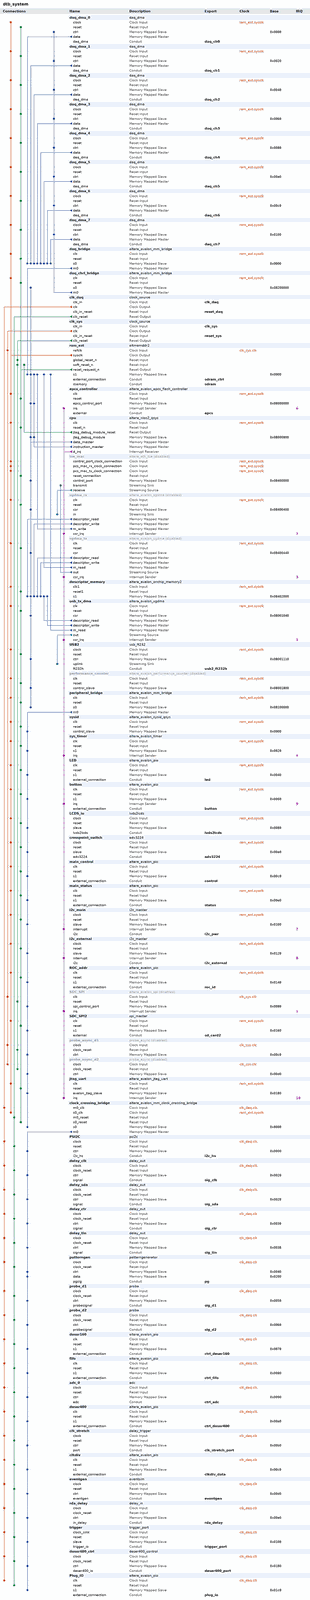
[diagram p0: system contents, whole]
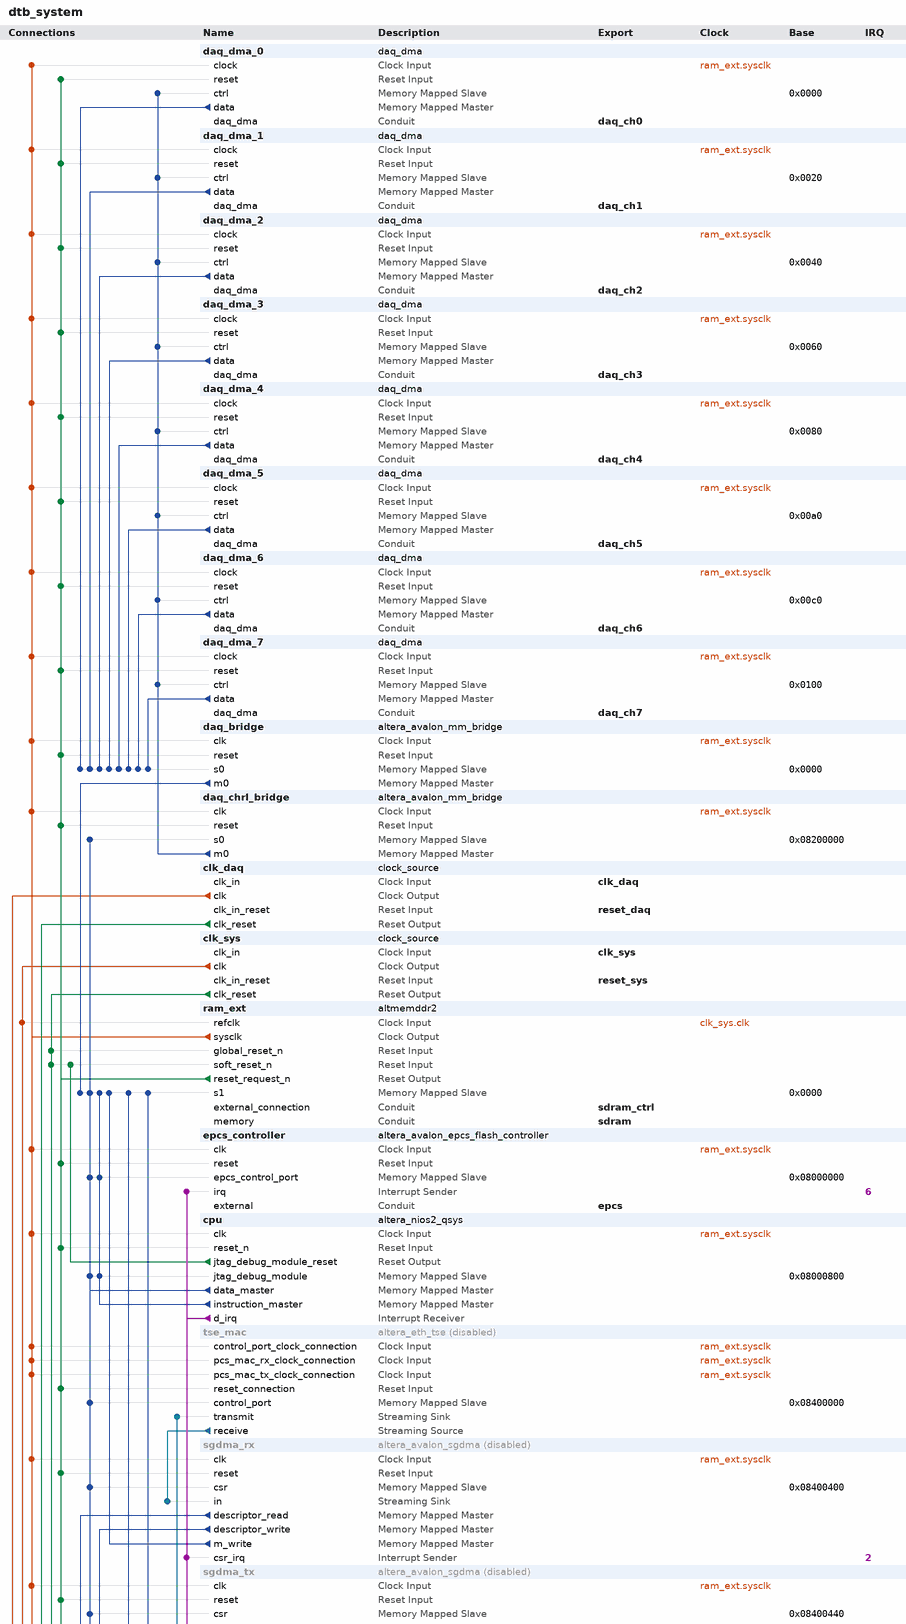
[diagram p1: system contents, upper part]
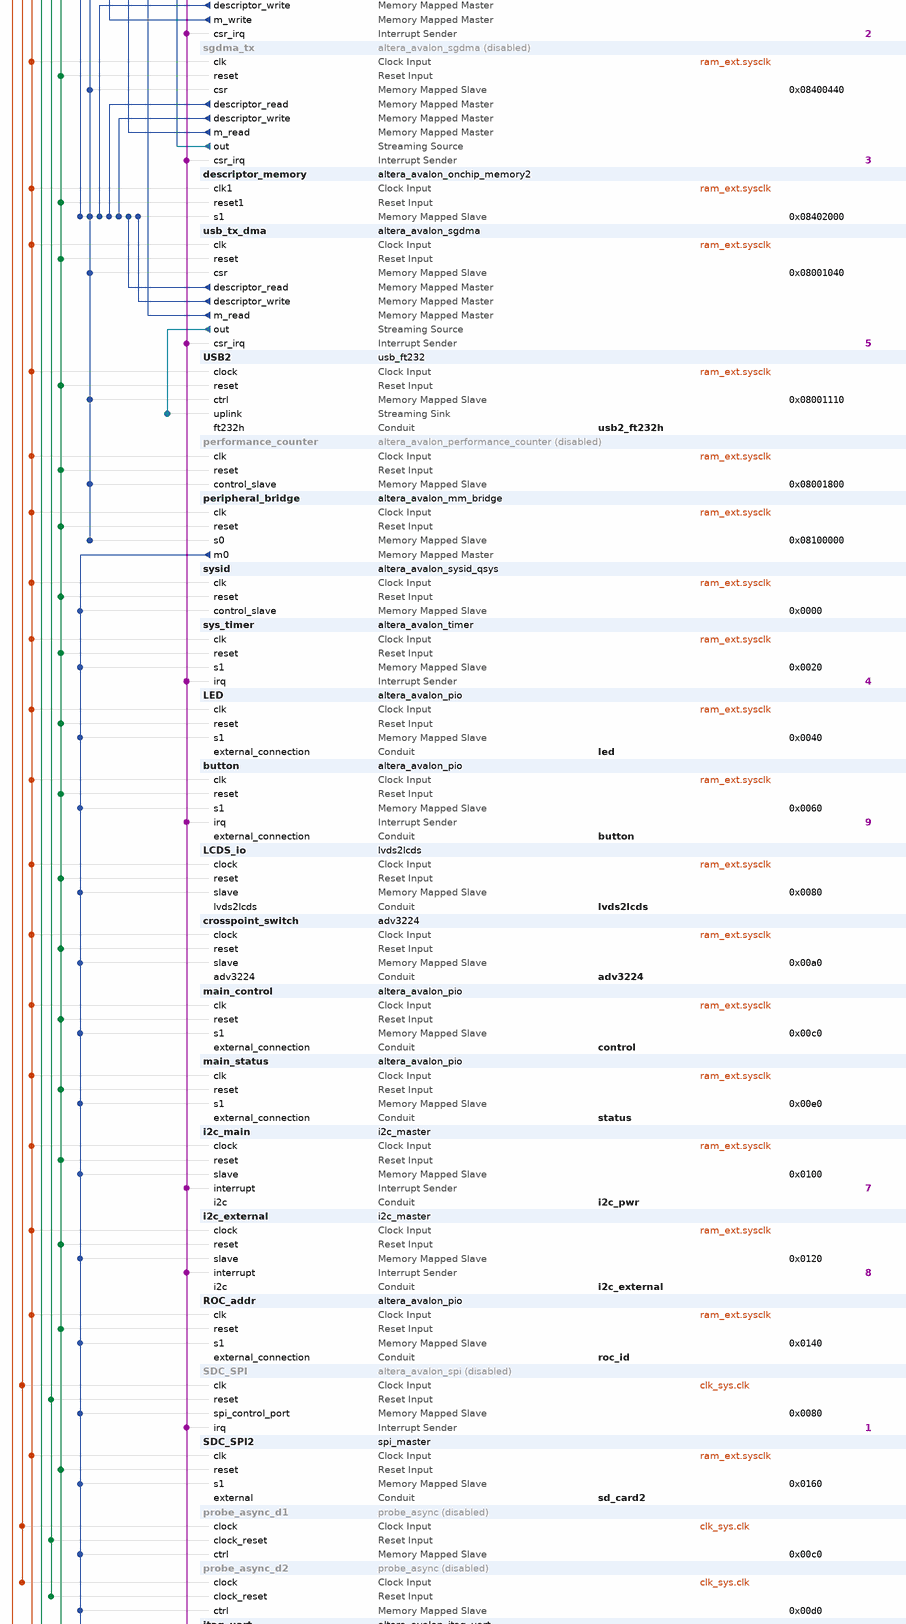
[diagram p2: system contents, middle part]
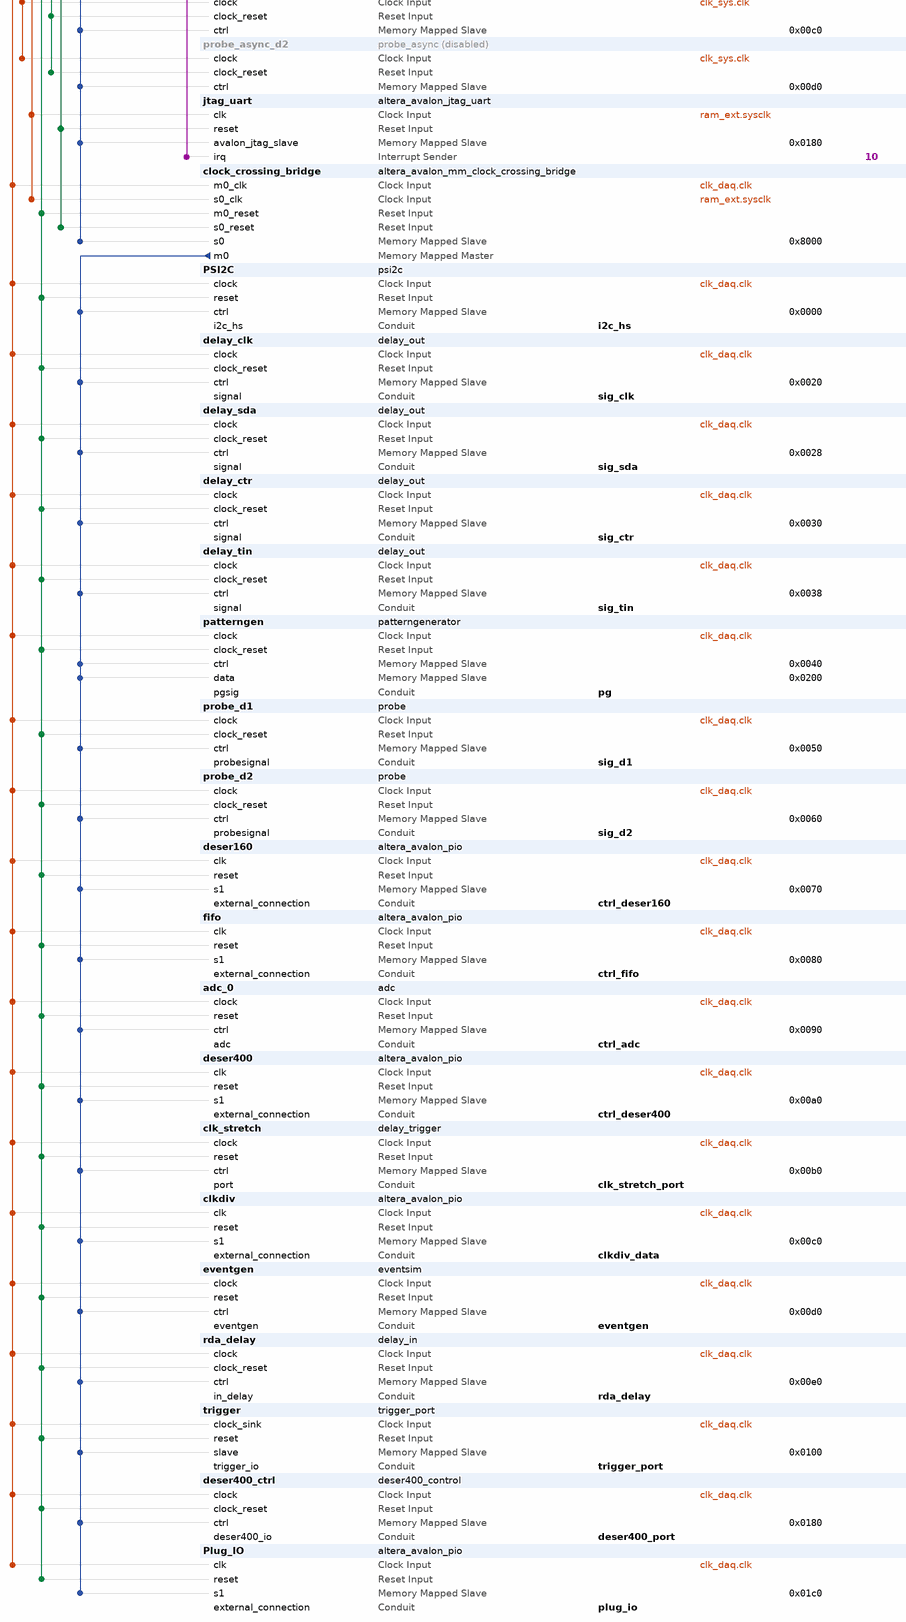
[diagram p3: system contents, lower part]
# Platform Designer (Qsys) system dtb_system, Cyclone III EP3C40F484C6
# Parameters at their usual value, and those the tool derives, are not listed.
package require -exact qsys 13.1
create_system dtb_system
set_project_property DEVICE_FAMILY {Cyclone III}
set_project_property DEVICE EP3C40F484C6

add_instance daq_dma_0 daq_dma 1.1

add_instance daq_dma_1 daq_dma 1.1

add_instance daq_dma_2 daq_dma 1.1

add_instance daq_dma_3 daq_dma 1.1

add_instance daq_dma_4 daq_dma 1.1

add_instance daq_dma_5 daq_dma 1.1

add_instance daq_dma_6 daq_dma 1.1

add_instance daq_dma_7 daq_dma 1.1

add_instance daq_bridge altera_avalon_mm_bridge 13.1
set_instance_parameter_value daq_bridge DATA_WIDTH 32
set_instance_parameter_value daq_bridge ADDRESS_WIDTH 27
set_instance_parameter_value daq_bridge ADDRESS_UNITS SYMBOLS
set_instance_parameter_value daq_bridge MAX_PENDING_RESPONSES 4

add_instance daq_chrl_bridge altera_avalon_mm_bridge 13.1
set_instance_parameter_value daq_chrl_bridge DATA_WIDTH 32
set_instance_parameter_value daq_chrl_bridge ADDRESS_WIDTH 10
set_instance_parameter_value daq_chrl_bridge ADDRESS_UNITS SYMBOLS
set_instance_parameter_value daq_chrl_bridge MAX_PENDING_RESPONSES 4

add_instance clk_daq clock_source 13.1
set_instance_parameter_value clk_daq clockFrequency 80000000

add_instance clk_sys clock_source 13.1
set_instance_parameter_value clk_sys clockFrequency 50000000

add_instance ram_ext altmemddr2 13.1
set_instance_parameter_value ram_ext pipeline_commands true
set_instance_parameter_value ram_ext debug_en false
set_instance_parameter_value ram_ext export_debug_port false
set_instance_parameter_value ram_ext use_generated_memory_model true
set_instance_parameter_value ram_ext dedicated_memory_clk_phase_label {Dedicated memory clock phase:}
set_instance_parameter_value ram_ext mem_if_clk_mhz 150.0
set_instance_parameter_value ram_ext quartus_project_exists false
set_instance_parameter_value ram_ext local_if_drate Half
set_instance_parameter_value ram_ext enable_v72_rsu false
set_instance_parameter_value ram_ext local_if_clk_mhz_label 75.0
set_instance_parameter_value ram_ext new_variant true
set_instance_parameter_value ram_ext mem_if_memtype {DDR2 SDRAM}
set_instance_parameter_value ram_ext pll_ref_clk_mhz 50.0
set_instance_parameter_value ram_ext mem_if_clk_ps_label {(6667 ps)}
set_instance_parameter_value ram_ext family {Cyclone III}
set_instance_parameter_value ram_ext project_family {Cyclone III}
set_instance_parameter_value ram_ext speed_grade 6
set_instance_parameter_value ram_ext dedicated_memory_clk_phase 0
set_instance_parameter_value ram_ext pll_ref_clk_ps_label {(20000 ps)}
set_instance_parameter_value ram_ext avalon_burst_length 1
set_instance_parameter_value ram_ext mem_if_clk_pair_count 1
set_instance_parameter_value ram_ext mem_if_cs_per_dimm 1
set_instance_parameter_value ram_ext pre_latency_label {Fix read latency at:}
set_instance_parameter_value ram_ext dedicated_memory_clk_en false
set_instance_parameter_value ram_ext mirror_addressing 0
set_instance_parameter_value ram_ext mem_if_bankaddr_width 2
set_instance_parameter_value ram_ext register_control_word_9 0000
set_instance_parameter_value ram_ext mem_if_rowaddr_width 13
set_instance_parameter_value ram_ext mem_dyn_deskew_en false
set_instance_parameter_value ram_ext post_latency_label {cycles (0 cycles=minimum latency, non-deterministic)}
set_instance_parameter_value ram_ext mem_if_dm_pins_en Yes
set_instance_parameter_value ram_ext local_if_dwidth_label 128
set_instance_parameter_value ram_ext register_control_word_7 0000
set_instance_parameter_value ram_ext register_control_word_8 0000
set_instance_parameter_value ram_ext mem_if_preset {Micron MT47H32M16CC-3}
set_instance_parameter_value ram_ext mem_if_pchaddr_bit 10
set_instance_parameter_value ram_ext WIDTH_RATIO 4
set_instance_parameter_value ram_ext vendor Micron
set_instance_parameter_value ram_ext register_control_word_3 0000
set_instance_parameter_value ram_ext register_control_word_4 0000
set_instance_parameter_value ram_ext chip_or_dimm {Discrete Device}
set_instance_parameter_value ram_ext register_control_word_5 0000
set_instance_parameter_value ram_ext register_control_word_6 0000
set_instance_parameter_value ram_ext mem_fmax 333.333
set_instance_parameter_value ram_ext register_control_word_0 0000
set_instance_parameter_value ram_ext register_control_word_size 4
set_instance_parameter_value ram_ext register_control_word_1 0000
set_instance_parameter_value ram_ext register_control_word_2 0000
set_instance_parameter_value ram_ext register_control_word_11 0000
set_instance_parameter_value ram_ext register_control_word_10 0000
set_instance_parameter_value ram_ext mem_if_cs_width 1
set_instance_parameter_value ram_ext mem_if_preset_rlat 0
set_instance_parameter_value ram_ext mem_if_cs_per_rank 1
set_instance_parameter_value ram_ext fast_simulation_en FAST
set_instance_parameter_value ram_ext register_control_word_15 0000
set_instance_parameter_value ram_ext register_control_word_14 0000
set_instance_parameter_value ram_ext mem_if_dwidth 32
set_instance_parameter_value ram_ext mem_if_dq_per_dqs 8
set_instance_parameter_value ram_ext mem_if_coladdr_width 10
set_instance_parameter_value ram_ext register_control_word_13 0000
set_instance_parameter_value ram_ext register_control_word_12 0000
set_instance_parameter_value ram_ext mem_tiha_ps 400
set_instance_parameter_value ram_ext mem_tdsh_ck 0.2
set_instance_parameter_value ram_ext mem_if_trfc_ns 105.0
set_instance_parameter_value ram_ext mem_tqh_ck 0.36
set_instance_parameter_value ram_ext mem_tisa_ps 400
set_instance_parameter_value ram_ext mem_tdss_ck 0.2
set_instance_parameter_value ram_ext mem_trtp_ns 7.5
set_instance_parameter_value ram_ext mem_if_tinit_us 200.0
set_instance_parameter_value ram_ext mem_if_trcd_ns 15.0
set_instance_parameter_value ram_ext mem_if_twtr_ck 3
set_instance_parameter_value ram_ext mem_trrd_ns 10.0
set_instance_parameter_value ram_ext mem_tdqss_ck 0.25
set_instance_parameter_value ram_ext mem_tqhs_ps 340
set_instance_parameter_value ram_ext mem_tdsa_ps 300
set_instance_parameter_value ram_ext mem_tac_ps 450
set_instance_parameter_value ram_ext mem_tdha_ps 300
set_instance_parameter_value ram_ext mem_if_tras_ns 40.0
set_instance_parameter_value ram_ext mem_if_twr_ns 15.0
set_instance_parameter_value ram_ext mem_tdqsck_ps 400
set_instance_parameter_value ram_ext mem_if_trp_ns 15.0
set_instance_parameter_value ram_ext mem_tdqsq_ps 240
set_instance_parameter_value ram_ext mem_if_tmrd_ns 6.0
set_instance_parameter_value ram_ext mem_tfaw_ns 50.0
set_instance_parameter_value ram_ext mem_if_trefi_us 7.8
set_instance_parameter_value ram_ext mem_tcl_40_fmax 266.667
set_instance_parameter_value ram_ext mem_odt 50
set_instance_parameter_value ram_ext mp_WLH_percent 0.6
set_instance_parameter_value ram_ext mem_drv_str Normal
set_instance_parameter_value ram_ext mp_DH_percent 0.5
set_instance_parameter_value ram_ext input_period 0
set_instance_parameter_value ram_ext mp_QH_percent 0.5
set_instance_parameter_value ram_ext mp_QHS_percent 0.5
set_instance_parameter_value ram_ext mem_tcl_30_fmax 200.0
set_instance_parameter_value ram_ext ac_clk_select 90
set_instance_parameter_value ram_ext mp_DQSQ_percent 0.65
set_instance_parameter_value ram_ext mp_DS_percent 0.6
set_instance_parameter_value ram_ext pll_reconfig_ports_en false
set_instance_parameter_value ram_ext mem_btype Sequential
set_instance_parameter_value ram_ext mp_IS_percent 0.7
set_instance_parameter_value ram_ext mem_tcl 3.0
set_instance_parameter_value ram_ext mp_DQSS_percent 0.5
set_instance_parameter_value ram_ext export_bank_info false
set_instance_parameter_value ram_ext mp_DSS_percent 0.6
set_instance_parameter_value ram_ext mem_dll_en Yes
set_instance_parameter_value ram_ext ac_phase 90
set_instance_parameter_value ram_ext mem_if_oct_en false
set_instance_parameter_value ram_ext mem_tcl_60_fmax 333.333
set_instance_parameter_value ram_ext mp_DSH_percent 0.6
set_instance_parameter_value ram_ext mem_if_dqsn_en false
set_instance_parameter_value ram_ext enable_mp_calibration true
set_instance_parameter_value ram_ext mp_IH_percent 0.6
set_instance_parameter_value ram_ext mem_tcl_15_fmax 533.0
set_instance_parameter_value ram_ext dll_external false
set_instance_parameter_value ram_ext mem_bl 8
set_instance_parameter_value ram_ext mp_WLS_percent 0.7
set_instance_parameter_value ram_ext mem_tcl_50_fmax 333.333
set_instance_parameter_value ram_ext mp_DQSCK_percent 0.5
set_instance_parameter_value ram_ext mem_tcl_25_fmax 533.0
set_instance_parameter_value ram_ext mem_tcl_20_fmax 533.0
set_instance_parameter_value ram_ext cfg_reorder_data false
set_instance_parameter_value ram_ext ctl_ecc_en false
set_instance_parameter_value ram_ext ctl_hrb_en false
set_instance_parameter_value ram_ext ref_clk_source clk_sys
set_instance_parameter_value ram_ext cfg_data_reordering_type INTER_BANK
set_instance_parameter_value ram_ext ctl_powerdn_en false
set_instance_parameter_value ram_ext multicast_wr_en false
set_instance_parameter_value ram_ext auto_powerdn_cycles 0
set_instance_parameter_value ram_ext ctl_self_refresh_en false
set_instance_parameter_value ram_ext cfg_starve_limit 10
set_instance_parameter_value ram_ext ctl_latency 0
set_instance_parameter_value ram_ext tool_context SOPC_BUILDER
set_instance_parameter_value ram_ext mem_addr_mapping CHIP_ROW_BANK_COL
set_instance_parameter_value ram_ext burst_merge_en false
set_instance_parameter_value ram_ext user_refresh_en false
set_instance_parameter_value ram_ext qsys_mode true
set_instance_parameter_value ram_ext clk_source_sharing_en false
set_instance_parameter_value ram_ext ctl_lookahead_depth 4
set_instance_parameter_value ram_ext ctl_autopch_en false
set_instance_parameter_value ram_ext ctl_dynamic_bank_allocation false
set_instance_parameter_value ram_ext ctl_dynamic_bank_num 4
set_instance_parameter_value ram_ext local_if_type_avalon true
set_instance_parameter_value ram_ext csr_en false
set_instance_parameter_value ram_ext ctl_auto_correct_en false
set_instance_parameter_value ram_ext auto_powerdn_en false
set_instance_parameter_value ram_ext phy_if_type_afi true
set_instance_parameter_value ram_ext controller_type ddrx_ctl
set_instance_parameter_value ram_ext max_local_size 4
set_instance_parameter_value ram_ext mem_srtr Normal
set_instance_parameter_value ram_ext mem_mpr_loc {Predefined Pattern}
set_instance_parameter_value ram_ext dss_tinit_rst_us 200.0
set_instance_parameter_value ram_ext mem_tcl_90_fmax 400.0
set_instance_parameter_value ram_ext mem_rtt_wr {Dynamic ODT off}
set_instance_parameter_value ram_ext mem_tcl_100_fmax 400.0
set_instance_parameter_value ram_ext mem_pasr {Full Array}
set_instance_parameter_value ram_ext mem_asrm {Manual SR Reference (SRT)}
set_instance_parameter_value ram_ext mem_mpr_oper {Predefined Pattern}
set_instance_parameter_value ram_ext mem_tcl_80_fmax 400.0
set_instance_parameter_value ram_ext mem_drv_impedance RZQ/7
set_instance_parameter_value ram_ext mem_rtt_nom {ODT Disabled}
set_instance_parameter_value ram_ext mem_tcl_70_fmax 400.0
set_instance_parameter_value ram_ext mem_wtcl 5.0
set_instance_parameter_value ram_ext mem_dll_pch {Fast Exit}
set_instance_parameter_value ram_ext mem_atcl Disabled
set_instance_parameter_value ram_ext board_settings_valid true
set_instance_parameter_value ram_ext t_IH 0.3
set_instance_parameter_value ram_ext board_intra_DQS_group_skew 0.05
set_instance_parameter_value ram_ext isi_DQS 0.0
set_instance_parameter_value ram_ext addr_cmd_slew_rate 1.0
set_instance_parameter_value ram_ext board_tpd_inter_DIMM 0.05
set_instance_parameter_value ram_ext board_addresscmd_CK_skew 0.0
set_instance_parameter_value ram_ext t_DS_calculated 0.300
set_instance_parameter_value ram_ext isi_addresscmd_hold 0.0
set_instance_parameter_value ram_ext t_IS 0.3
set_instance_parameter_value ram_ext restore_default_toggle false
set_instance_parameter_value ram_ext dqs_dqsn_slew_rate 2.0
set_instance_parameter_value ram_ext dq_slew_rate 1.0
set_instance_parameter_value ram_ext board_inter_DQS_group_skew 0.02
set_instance_parameter_value ram_ext isi_addresscmd_setup 0.0
set_instance_parameter_value ram_ext board_minCK_DQS_skew -0.01
set_instance_parameter_value ram_ext t_IS_calculated 0.400
set_instance_parameter_value ram_ext num_slots_or_devices 1
set_instance_parameter_value ram_ext board_maxCK_DQS_skew 0.01
set_instance_parameter_value ram_ext board_skew_ps 50
set_instance_parameter_value ram_ext t_DH 0.2
set_instance_parameter_value ram_ext ck_ckn_slew_rate 2.0
set_instance_parameter_value ram_ext isi_DQ 0.0
set_instance_parameter_value ram_ext t_IH_calculated 0.400
set_instance_parameter_value ram_ext t_DH_calculated 0.300
set_instance_parameter_value ram_ext t_DS 0.2

add_instance epcs_controller altera_avalon_epcs_flash_controller 13.1

add_instance cpu altera_nios2_qsys 13.1
set_instance_parameter_value cpu muldiv_divider true
set_instance_parameter_value cpu mmu_autoAssignTlbPtrSz false
set_instance_parameter_value cpu manuallyAssignCpuID false
set_instance_parameter_value cpu exceptionOffset 288
set_instance_parameter_value cpu resetSlave epcs_controller.epcs_control_port
set_instance_parameter_value cpu exceptionSlave ram_ext.s1
set_instance_parameter_value cpu breakSlave cpu.jtag_debug_module
set_instance_parameter_value cpu impl Fast
set_instance_parameter_value cpu icache_size 4096
set_instance_parameter_value cpu icache_burstType Sequential
set_instance_parameter_value cpu dcache_bursts true
set_instance_parameter_value cpu dcache_size 4096

add_instance tse_mac altera_eth_tse 13.1
set_instance_property tse_mac ENABLED false
set_instance_parameter_value tse_mac core_variation MAC_ONLY
set_instance_parameter_value tse_mac ifGMII RGMII
set_instance_parameter_value tse_mac transceiver_type NONE
set_instance_parameter_value tse_mac enable_hd_logic true
set_instance_parameter_value tse_mac stat_cnt_ena true
set_instance_parameter_value tse_mac enable_shift16 true
set_instance_parameter_value tse_mac enable_mac_flow_ctrl true
set_instance_parameter_value tse_mac enable_magic_detect false
set_instance_parameter_value tse_mac mdio_clk_div 40
set_instance_parameter_value tse_mac eg_addr 10
set_instance_parameter_value tse_mac ing_addr 10

add_instance sgdma_rx altera_avalon_sgdma 13.1
set_instance_property sgdma_rx ENABLED false
set_instance_parameter_value sgdma_rx enableBurstTransfers false
set_instance_parameter_value sgdma_rx enableUnalignedTransfers false
set_instance_parameter_value sgdma_rx readBlockDataWidth 32
set_instance_parameter_value sgdma_rx sinkErrorWidth 6
set_instance_parameter_value sgdma_rx sourceErrorWidth 0
set_instance_parameter_value sgdma_rx transferMode STREAM_TO_MEMORY
set_instance_parameter_value sgdma_rx writeBurstcountWidth 3

add_instance sgdma_tx altera_avalon_sgdma 13.1
set_instance_property sgdma_tx ENABLED false
set_instance_parameter_value sgdma_tx enableBurstTransfers false
set_instance_parameter_value sgdma_tx enableUnalignedTransfers false
set_instance_parameter_value sgdma_tx readBlockDataWidth 32
set_instance_parameter_value sgdma_tx readBurstcountWidth 3
set_instance_parameter_value sgdma_tx sinkErrorWidth 0
set_instance_parameter_value sgdma_tx sourceErrorWidth 1
set_instance_parameter_value sgdma_tx transferMode MEMORY_TO_STREAM
set_instance_parameter_value sgdma_tx writeBurstcountWidth 4

add_instance descriptor_memory altera_avalon_onchip_memory2 13.1
set_instance_parameter_value descriptor_memory dataWidth 32
set_instance_parameter_value descriptor_memory dualPort false
set_instance_parameter_value descriptor_memory initMemContent true
set_instance_parameter_value descriptor_memory initializationFileName descriptor_memory
set_instance_parameter_value descriptor_memory memorySize 256

add_instance usb_tx_dma altera_avalon_sgdma 13.1
set_instance_parameter_value usb_tx_dma enableBurstTransfers true
set_instance_parameter_value usb_tx_dma enableDescriptorReadMasterBurst true
set_instance_parameter_value usb_tx_dma enableUnalignedTransfers false
set_instance_parameter_value usb_tx_dma readBlockDataWidth 16
set_instance_parameter_value usb_tx_dma sinkErrorWidth 0
set_instance_parameter_value usb_tx_dma sourceErrorWidth 0
set_instance_parameter_value usb_tx_dma transferMode MEMORY_TO_STREAM
set_instance_parameter_value usb_tx_dma writeBurstcountWidth 4

add_instance USB2 usb_ft232 1.0

add_instance performance_counter altera_avalon_performance_counter 13.1
set_instance_property performance_counter ENABLED false
set_instance_parameter_value performance_counter numberOfSections 3

add_instance peripheral_bridge altera_avalon_mm_bridge 13.1
set_instance_parameter_value peripheral_bridge DATA_WIDTH 32
set_instance_parameter_value peripheral_bridge ADDRESS_WIDTH 16
set_instance_parameter_value peripheral_bridge ADDRESS_UNITS SYMBOLS
set_instance_parameter_value peripheral_bridge MAX_PENDING_RESPONSES 4

add_instance sysid altera_avalon_sysid_qsys 13.1
set_instance_parameter_value sysid id 1

add_instance sys_timer altera_avalon_timer 13.1
set_instance_parameter_value sys_timer period 10
set_instance_parameter_value sys_timer periodUnits MSEC

add_instance LED altera_avalon_pio 13.1
set_instance_parameter_value LED direction Output
set_instance_parameter_value LED width 4

add_instance button altera_avalon_pio 13.1
set_instance_parameter_value button captureEdge true
set_instance_parameter_value button direction Input
set_instance_parameter_value button edgeType ANY
set_instance_parameter_value button generateIRQ true
set_instance_parameter_value button irqType EDGE
set_instance_parameter_value button width 2

add_instance LCDS_io lvds2lcds 1.0
set_instance_parameter_value LCDS_io divider 80

add_instance crosspoint_switch adv3224 1.0
set_instance_parameter_value crosspoint_switch divider 50

add_instance main_control altera_avalon_pio 13.1
set_instance_parameter_value main_control direction Output
set_instance_parameter_value main_control width 9

add_instance main_status altera_avalon_pio 13.1
set_instance_parameter_value main_status direction Input
set_instance_parameter_value main_status width 7

add_instance i2c_main i2c_master 1.0

add_instance i2c_external i2c_master 1.0

add_instance ROC_addr altera_avalon_pio 13.1
set_instance_parameter_value ROC_addr direction Output
set_instance_parameter_value ROC_addr width 4

add_instance SDC_SPI altera_avalon_spi 13.1
set_instance_property SDC_SPI ENABLED false
set_instance_parameter_value SDC_SPI clockPolarity 0
set_instance_parameter_value SDC_SPI dataWidth 8
set_instance_parameter_value SDC_SPI masterSPI true
set_instance_parameter_value SDC_SPI numberOfSlaves 1
set_instance_parameter_value SDC_SPI targetClockRate 6300000
set_instance_parameter_value SDC_SPI targetSlaveSelectToSClkDelay 160.0

add_instance SDC_SPI2 spi_master 1.1

add_instance probe_async_d1 probe_async 1.0
set_instance_property probe_async_d1 ENABLED false

add_instance probe_async_d2 probe_async 1.0
set_instance_property probe_async_d2 ENABLED false

add_instance jtag_uart altera_avalon_jtag_uart 13.1
set_instance_parameter_value jtag_uart simInteractiveOptions INTERACTIVE_ASCII_OUTPUT

add_instance clock_crossing_bridge altera_avalon_mm_clock_crossing_bridge 13.1
set_instance_parameter_value clock_crossing_bridge DATA_WIDTH 32
set_instance_parameter_value clock_crossing_bridge ADDRESS_WIDTH 15
set_instance_parameter_value clock_crossing_bridge MAX_BURST_SIZE 1
set_instance_parameter_value clock_crossing_bridge COMMAND_FIFO_DEPTH 4
set_instance_parameter_value clock_crossing_bridge RESPONSE_FIFO_DEPTH 4
set_instance_parameter_value clock_crossing_bridge MASTER_SYNC_DEPTH 2
set_instance_parameter_value clock_crossing_bridge SLAVE_SYNC_DEPTH 2

add_instance PSI2C psi2c 1.0

add_instance delay_clk delay_out 1.2

add_instance delay_sda delay_out 1.2

add_instance delay_ctr delay_out 1.2

add_instance delay_tin delay_out 1.2

add_instance patterngen patterngenerator 1.1

add_instance probe_d1 probe 1.0

add_instance probe_d2 probe 1.0

add_instance deser160 altera_avalon_pio 13.1
set_instance_parameter_value deser160 direction Output
set_instance_parameter_value deser160 width 4

add_instance fifo altera_avalon_pio 13.1
set_instance_parameter_value fifo direction Output
set_instance_parameter_value fifo width 1

add_instance adc_0 adc 1.0

add_instance deser400 altera_avalon_pio 13.1
set_instance_parameter_value deser400 direction Output
set_instance_parameter_value deser400 width 3

add_instance clk_stretch delay_trigger 1.1

add_instance clkdiv altera_avalon_pio 13.1
set_instance_parameter_value clkdiv direction Output
set_instance_parameter_value clkdiv width 6

add_instance eventgen eventsim 1.0

add_instance rda_delay delay_in 1.0

add_instance trigger trigger_port 1.0

add_instance deser400_ctrl deser400_control 1.0

add_instance Plug_IO altera_avalon_pio 13.1
set_instance_parameter_value Plug_IO bitModifyingOutReg true
set_instance_parameter_value Plug_IO direction Output
set_instance_parameter_value Plug_IO width 4

# connections
add_connection clk_daq.clk adc_0.clock clock
add_connection clk_daq.clk clk_stretch.clock clock
add_connection clk_daq.clk clkdiv.clk clock
add_connection clk_daq.clk clock_crossing_bridge.m0_clk clock
add_connection clk_daq.clk delay_clk.clock clock
add_connection clk_daq.clk delay_ctr.clock clock
add_connection clk_daq.clk delay_sda.clock clock
add_connection clk_daq.clk delay_tin.clock clock
add_connection clk_daq.clk deser160.clk clock
add_connection clk_daq.clk deser400.clk clock
add_connection clk_daq.clk deser400_ctrl.clock clock
add_connection clk_daq.clk eventgen.clock clock
add_connection clk_daq.clk fifo.clk clock
add_connection clk_daq.clk patterngen.clock clock
add_connection clk_daq.clk Plug_IO.clk clock
add_connection clk_daq.clk probe_d1.clock clock
add_connection clk_daq.clk probe_d2.clock clock
add_connection clk_daq.clk PSI2C.clock clock
add_connection clk_daq.clk rda_delay.clock clock
add_connection clk_daq.clk trigger.clock_sink clock
add_connection clk_sys.clk probe_async_d1.clock clock
add_connection clk_sys.clk probe_async_d2.clock clock
add_connection clk_sys.clk ram_ext.refclk clock
add_connection clk_sys.clk SDC_SPI.clk clock
add_connection ram_ext.sysclk button.clk clock
add_connection ram_ext.sysclk clock_crossing_bridge.s0_clk clock
add_connection ram_ext.sysclk cpu.clk clock
add_connection ram_ext.sysclk crosspoint_switch.clock clock
add_connection ram_ext.sysclk daq_bridge.clk clock
add_connection ram_ext.sysclk daq_chrl_bridge.clk clock
add_connection ram_ext.sysclk daq_dma_0.clock clock
add_connection ram_ext.sysclk daq_dma_1.clock clock
add_connection ram_ext.sysclk daq_dma_2.clock clock
add_connection ram_ext.sysclk daq_dma_3.clock clock
add_connection ram_ext.sysclk daq_dma_4.clock clock
add_connection ram_ext.sysclk daq_dma_5.clock clock
add_connection ram_ext.sysclk daq_dma_6.clock clock
add_connection ram_ext.sysclk daq_dma_7.clock clock
add_connection ram_ext.sysclk descriptor_memory.clk1 clock
add_connection ram_ext.sysclk epcs_controller.clk clock
add_connection ram_ext.sysclk i2c_external.clock clock
add_connection ram_ext.sysclk i2c_main.clock clock
add_connection ram_ext.sysclk jtag_uart.clk clock
add_connection ram_ext.sysclk LCDS_io.clock clock
add_connection ram_ext.sysclk LED.clk clock
add_connection ram_ext.sysclk main_control.clk clock
add_connection ram_ext.sysclk main_status.clk clock
add_connection ram_ext.sysclk performance_counter.clk clock
add_connection ram_ext.sysclk peripheral_bridge.clk clock
add_connection ram_ext.sysclk ROC_addr.clk clock
add_connection ram_ext.sysclk SDC_SPI2.clk clock
add_connection ram_ext.sysclk sgdma_rx.clk clock
add_connection ram_ext.sysclk sgdma_tx.clk clock
add_connection ram_ext.sysclk sys_timer.clk clock
add_connection ram_ext.sysclk sysid.clk clock
add_connection ram_ext.sysclk tse_mac.control_port_clock_connection clock
add_connection ram_ext.sysclk tse_mac.pcs_mac_rx_clock_connection clock
add_connection ram_ext.sysclk tse_mac.pcs_mac_tx_clock_connection clock
add_connection ram_ext.sysclk USB2.clock clock
add_connection ram_ext.sysclk usb_tx_dma.clk clock
add_connection clk_daq.clk_reset adc_0.reset reset
add_connection clk_daq.clk_reset clk_stretch.reset reset
add_connection clk_daq.clk_reset clkdiv.reset reset
add_connection clk_daq.clk_reset clock_crossing_bridge.m0_reset reset
add_connection clk_daq.clk_reset delay_clk.clock_reset reset
add_connection clk_daq.clk_reset delay_ctr.clock_reset reset
add_connection clk_daq.clk_reset delay_sda.clock_reset reset
add_connection clk_daq.clk_reset delay_tin.clock_reset reset
add_connection clk_daq.clk_reset deser160.reset reset
add_connection clk_daq.clk_reset deser400.reset reset
add_connection clk_daq.clk_reset deser400_ctrl.clock_reset reset
add_connection clk_daq.clk_reset eventgen.reset reset
add_connection clk_daq.clk_reset fifo.reset reset
add_connection clk_daq.clk_reset patterngen.clock_reset reset
add_connection clk_daq.clk_reset Plug_IO.reset reset
add_connection clk_daq.clk_reset probe_d1.clock_reset reset
add_connection clk_daq.clk_reset probe_d2.clock_reset reset
add_connection clk_daq.clk_reset PSI2C.reset reset
add_connection clk_daq.clk_reset rda_delay.clock_reset reset
add_connection clk_daq.clk_reset trigger.reset reset
add_connection clk_sys.clk_reset probe_async_d1.clock_reset reset
add_connection clk_sys.clk_reset probe_async_d2.clock_reset reset
add_connection clk_sys.clk_reset ram_ext.global_reset_n reset
add_connection clk_sys.clk_reset ram_ext.soft_reset_n reset
add_connection clk_sys.clk_reset SDC_SPI.reset reset
add_connection cpu.jtag_debug_module_reset ram_ext.soft_reset_n reset
add_connection ram_ext.reset_request_n button.reset reset
add_connection ram_ext.reset_request_n clock_crossing_bridge.s0_reset reset
add_connection ram_ext.reset_request_n cpu.reset_n reset
add_connection ram_ext.reset_request_n crosspoint_switch.reset reset
add_connection ram_ext.reset_request_n daq_bridge.reset reset
add_connection ram_ext.reset_request_n daq_chrl_bridge.reset reset
add_connection ram_ext.reset_request_n daq_dma_0.reset reset
add_connection ram_ext.reset_request_n daq_dma_1.reset reset
add_connection ram_ext.reset_request_n daq_dma_2.reset reset
add_connection ram_ext.reset_request_n daq_dma_3.reset reset
add_connection ram_ext.reset_request_n daq_dma_4.reset reset
add_connection ram_ext.reset_request_n daq_dma_5.reset reset
add_connection ram_ext.reset_request_n daq_dma_6.reset reset
add_connection ram_ext.reset_request_n daq_dma_7.reset reset
add_connection ram_ext.reset_request_n descriptor_memory.reset1 reset
add_connection ram_ext.reset_request_n epcs_controller.reset reset
add_connection ram_ext.reset_request_n i2c_external.reset reset
add_connection ram_ext.reset_request_n i2c_main.reset reset
add_connection ram_ext.reset_request_n jtag_uart.reset reset
add_connection ram_ext.reset_request_n LCDS_io.reset reset
add_connection ram_ext.reset_request_n LED.reset reset
add_connection ram_ext.reset_request_n main_control.reset reset
add_connection ram_ext.reset_request_n main_status.reset reset
add_connection ram_ext.reset_request_n performance_counter.reset reset
add_connection ram_ext.reset_request_n peripheral_bridge.reset reset
add_connection ram_ext.reset_request_n ROC_addr.reset reset
add_connection ram_ext.reset_request_n SDC_SPI2.reset reset
add_connection ram_ext.reset_request_n sgdma_rx.reset reset
add_connection ram_ext.reset_request_n sgdma_tx.reset reset
add_connection ram_ext.reset_request_n sys_timer.reset reset
add_connection ram_ext.reset_request_n sysid.reset reset
add_connection ram_ext.reset_request_n tse_mac.reset_connection reset
add_connection ram_ext.reset_request_n USB2.reset reset
add_connection ram_ext.reset_request_n usb_tx_dma.reset reset
add_connection clock_crossing_bridge.m0 adc_0.ctrl avalon
set_connection_parameter_value clock_crossing_bridge.m0/adc_0.ctrl baseAddress 0x0090
add_connection clock_crossing_bridge.m0 clk_stretch.ctrl avalon
set_connection_parameter_value clock_crossing_bridge.m0/clk_stretch.ctrl baseAddress 0x00b0
add_connection clock_crossing_bridge.m0 clkdiv.s1 avalon
set_connection_parameter_value clock_crossing_bridge.m0/clkdiv.s1 baseAddress 0x00c0
add_connection clock_crossing_bridge.m0 delay_clk.ctrl avalon
set_connection_parameter_value clock_crossing_bridge.m0/delay_clk.ctrl baseAddress 0x0020
add_connection clock_crossing_bridge.m0 delay_ctr.ctrl avalon
set_connection_parameter_value clock_crossing_bridge.m0/delay_ctr.ctrl baseAddress 0x0030
add_connection clock_crossing_bridge.m0 delay_sda.ctrl avalon
set_connection_parameter_value clock_crossing_bridge.m0/delay_sda.ctrl baseAddress 0x0028
add_connection clock_crossing_bridge.m0 delay_tin.ctrl avalon
set_connection_parameter_value clock_crossing_bridge.m0/delay_tin.ctrl baseAddress 0x0038
add_connection clock_crossing_bridge.m0 deser160.s1 avalon
set_connection_parameter_value clock_crossing_bridge.m0/deser160.s1 baseAddress 0x0070
add_connection clock_crossing_bridge.m0 deser400.s1 avalon
set_connection_parameter_value clock_crossing_bridge.m0/deser400.s1 baseAddress 0x00a0
add_connection clock_crossing_bridge.m0 deser400_ctrl.ctrl avalon
set_connection_parameter_value clock_crossing_bridge.m0/deser400_ctrl.ctrl baseAddress 0x0180
add_connection clock_crossing_bridge.m0 eventgen.ctrl avalon
set_connection_parameter_value clock_crossing_bridge.m0/eventgen.ctrl baseAddress 0x00d0
add_connection clock_crossing_bridge.m0 fifo.s1 avalon
set_connection_parameter_value clock_crossing_bridge.m0/fifo.s1 baseAddress 0x0080
add_connection clock_crossing_bridge.m0 patterngen.ctrl avalon
set_connection_parameter_value clock_crossing_bridge.m0/patterngen.ctrl baseAddress 0x0040
add_connection clock_crossing_bridge.m0 patterngen.data avalon
set_connection_parameter_value clock_crossing_bridge.m0/patterngen.data baseAddress 0x0200
add_connection clock_crossing_bridge.m0 Plug_IO.s1 avalon
set_connection_parameter_value clock_crossing_bridge.m0/Plug_IO.s1 baseAddress 0x01c0
add_connection clock_crossing_bridge.m0 probe_d1.ctrl avalon
set_connection_parameter_value clock_crossing_bridge.m0/probe_d1.ctrl baseAddress 0x0050
add_connection clock_crossing_bridge.m0 probe_d2.ctrl avalon
set_connection_parameter_value clock_crossing_bridge.m0/probe_d2.ctrl baseAddress 0x0060
add_connection clock_crossing_bridge.m0 PSI2C.ctrl avalon
set_connection_parameter_value clock_crossing_bridge.m0/PSI2C.ctrl baseAddress 0x0000
add_connection clock_crossing_bridge.m0 rda_delay.ctrl avalon
set_connection_parameter_value clock_crossing_bridge.m0/rda_delay.ctrl baseAddress 0x00e0
add_connection clock_crossing_bridge.m0 trigger.slave avalon
set_connection_parameter_value clock_crossing_bridge.m0/trigger.slave baseAddress 0x0100
add_connection cpu.data_master cpu.jtag_debug_module avalon
set_connection_parameter_value cpu.data_master/cpu.jtag_debug_module baseAddress 0x08000800
add_connection cpu.data_master daq_chrl_bridge.s0 avalon
set_connection_parameter_value cpu.data_master/daq_chrl_bridge.s0 baseAddress 0x08200000
add_connection cpu.data_master descriptor_memory.s1 avalon
set_connection_parameter_value cpu.data_master/descriptor_memory.s1 baseAddress 0x08402000
add_connection cpu.data_master epcs_controller.epcs_control_port avalon
set_connection_parameter_value cpu.data_master/epcs_controller.epcs_control_port baseAddress 0x08000000
add_connection cpu.data_master performance_counter.control_slave avalon
set_connection_parameter_value cpu.data_master/performance_counter.control_slave baseAddress 0x08001800
add_connection cpu.data_master peripheral_bridge.s0 avalon
set_connection_parameter_value cpu.data_master/peripheral_bridge.s0 baseAddress 0x08100000
add_connection cpu.data_master ram_ext.s1 avalon
set_connection_parameter_value cpu.data_master/ram_ext.s1 baseAddress 0x0000
add_connection cpu.data_master sgdma_rx.csr avalon
set_connection_parameter_value cpu.data_master/sgdma_rx.csr baseAddress 0x08400400
add_connection cpu.data_master sgdma_tx.csr avalon
set_connection_parameter_value cpu.data_master/sgdma_tx.csr baseAddress 0x08400440
add_connection cpu.data_master tse_mac.control_port avalon
set_connection_parameter_value cpu.data_master/tse_mac.control_port baseAddress 0x08400000
add_connection cpu.data_master USB2.ctrl avalon
set_connection_parameter_value cpu.data_master/USB2.ctrl baseAddress 0x08001110
add_connection cpu.data_master usb_tx_dma.csr avalon
set_connection_parameter_value cpu.data_master/usb_tx_dma.csr baseAddress 0x08001040
add_connection cpu.instruction_master cpu.jtag_debug_module avalon
set_connection_parameter_value cpu.instruction_master/cpu.jtag_debug_module baseAddress 0x08000800
add_connection cpu.instruction_master epcs_controller.epcs_control_port avalon
set_connection_parameter_value cpu.instruction_master/epcs_controller.epcs_control_port baseAddress 0x08000000
add_connection cpu.instruction_master ram_ext.s1 avalon
set_connection_parameter_value cpu.instruction_master/ram_ext.s1 baseAddress 0x0000
add_connection daq_bridge.m0 ram_ext.s1 avalon
set_connection_parameter_value daq_bridge.m0/ram_ext.s1 baseAddress 0x0000
add_connection daq_chrl_bridge.m0 daq_dma_0.ctrl avalon
set_connection_parameter_value daq_chrl_bridge.m0/daq_dma_0.ctrl baseAddress 0x0000
add_connection daq_chrl_bridge.m0 daq_dma_1.ctrl avalon
set_connection_parameter_value daq_chrl_bridge.m0/daq_dma_1.ctrl baseAddress 0x0020
add_connection daq_chrl_bridge.m0 daq_dma_2.ctrl avalon
set_connection_parameter_value daq_chrl_bridge.m0/daq_dma_2.ctrl baseAddress 0x0040
add_connection daq_chrl_bridge.m0 daq_dma_3.ctrl avalon
set_connection_parameter_value daq_chrl_bridge.m0/daq_dma_3.ctrl baseAddress 0x0060
add_connection daq_chrl_bridge.m0 daq_dma_4.ctrl avalon
set_connection_parameter_value daq_chrl_bridge.m0/daq_dma_4.ctrl baseAddress 0x0080
add_connection daq_chrl_bridge.m0 daq_dma_5.ctrl avalon
set_connection_parameter_value daq_chrl_bridge.m0/daq_dma_5.ctrl baseAddress 0x00a0
add_connection daq_chrl_bridge.m0 daq_dma_6.ctrl avalon
set_connection_parameter_value daq_chrl_bridge.m0/daq_dma_6.ctrl baseAddress 0x00c0
add_connection daq_chrl_bridge.m0 daq_dma_7.ctrl avalon
set_connection_parameter_value daq_chrl_bridge.m0/daq_dma_7.ctrl baseAddress 0x0100
add_connection daq_dma_0.data daq_bridge.s0 avalon
set_connection_parameter_value daq_dma_0.data/daq_bridge.s0 baseAddress 0x0000
add_connection daq_dma_1.data daq_bridge.s0 avalon
set_connection_parameter_value daq_dma_1.data/daq_bridge.s0 baseAddress 0x0000
add_connection daq_dma_2.data daq_bridge.s0 avalon
set_connection_parameter_value daq_dma_2.data/daq_bridge.s0 baseAddress 0x0000
add_connection daq_dma_3.data daq_bridge.s0 avalon
set_connection_parameter_value daq_dma_3.data/daq_bridge.s0 baseAddress 0x0000
add_connection daq_dma_4.data daq_bridge.s0 avalon
set_connection_parameter_value daq_dma_4.data/daq_bridge.s0 baseAddress 0x0000
add_connection daq_dma_5.data daq_bridge.s0 avalon
set_connection_parameter_value daq_dma_5.data/daq_bridge.s0 baseAddress 0x0000
add_connection daq_dma_6.data daq_bridge.s0 avalon
set_connection_parameter_value daq_dma_6.data/daq_bridge.s0 baseAddress 0x0000
add_connection daq_dma_7.data daq_bridge.s0 avalon
set_connection_parameter_value daq_dma_7.data/daq_bridge.s0 baseAddress 0x0000
add_connection peripheral_bridge.m0 button.s1 avalon
set_connection_parameter_value peripheral_bridge.m0/button.s1 baseAddress 0x0060
add_connection peripheral_bridge.m0 clock_crossing_bridge.s0 avalon
set_connection_parameter_value peripheral_bridge.m0/clock_crossing_bridge.s0 baseAddress 0x8000
add_connection peripheral_bridge.m0 crosspoint_switch.slave avalon
set_connection_parameter_value peripheral_bridge.m0/crosspoint_switch.slave baseAddress 0x00a0
add_connection peripheral_bridge.m0 i2c_external.slave avalon
set_connection_parameter_value peripheral_bridge.m0/i2c_external.slave baseAddress 0x0120
add_connection peripheral_bridge.m0 i2c_main.slave avalon
set_connection_parameter_value peripheral_bridge.m0/i2c_main.slave baseAddress 0x0100
add_connection peripheral_bridge.m0 jtag_uart.avalon_jtag_slave avalon
set_connection_parameter_value peripheral_bridge.m0/jtag_uart.avalon_jtag_slave baseAddress 0x0180
add_connection peripheral_bridge.m0 LCDS_io.slave avalon
set_connection_parameter_value peripheral_bridge.m0/LCDS_io.slave baseAddress 0x0080
add_connection peripheral_bridge.m0 LED.s1 avalon
set_connection_parameter_value peripheral_bridge.m0/LED.s1 baseAddress 0x0040
add_connection peripheral_bridge.m0 main_control.s1 avalon
set_connection_parameter_value peripheral_bridge.m0/main_control.s1 baseAddress 0x00c0
add_connection peripheral_bridge.m0 main_status.s1 avalon
set_connection_parameter_value peripheral_bridge.m0/main_status.s1 baseAddress 0x00e0
add_connection peripheral_bridge.m0 probe_async_d1.ctrl avalon
set_connection_parameter_value peripheral_bridge.m0/probe_async_d1.ctrl baseAddress 0x00c0
add_connection peripheral_bridge.m0 probe_async_d2.ctrl avalon
set_connection_parameter_value peripheral_bridge.m0/probe_async_d2.ctrl baseAddress 0x00d0
add_connection peripheral_bridge.m0 ROC_addr.s1 avalon
set_connection_parameter_value peripheral_bridge.m0/ROC_addr.s1 baseAddress 0x0140
add_connection peripheral_bridge.m0 SDC_SPI2.s1 avalon
set_connection_parameter_value peripheral_bridge.m0/SDC_SPI2.s1 baseAddress 0x0160
add_connection peripheral_bridge.m0 SDC_SPI.spi_control_port avalon
set_connection_parameter_value peripheral_bridge.m0/SDC_SPI.spi_control_port baseAddress 0x0080
add_connection peripheral_bridge.m0 sys_timer.s1 avalon
set_connection_parameter_value peripheral_bridge.m0/sys_timer.s1 baseAddress 0x0020
add_connection peripheral_bridge.m0 sysid.control_slave avalon
set_connection_parameter_value peripheral_bridge.m0/sysid.control_slave baseAddress 0x0000
add_connection sgdma_rx.descriptor_read descriptor_memory.s1 avalon
set_connection_parameter_value sgdma_rx.descriptor_read/descriptor_memory.s1 baseAddress 0x08402000
add_connection sgdma_rx.descriptor_write descriptor_memory.s1 avalon
set_connection_parameter_value sgdma_rx.descriptor_write/descriptor_memory.s1 baseAddress 0x08402000
add_connection sgdma_rx.m_write ram_ext.s1 avalon
set_connection_parameter_value sgdma_rx.m_write/ram_ext.s1 baseAddress 0x0000
add_connection sgdma_tx.descriptor_read descriptor_memory.s1 avalon
set_connection_parameter_value sgdma_tx.descriptor_read/descriptor_memory.s1 baseAddress 0x08402000
add_connection sgdma_tx.descriptor_write descriptor_memory.s1 avalon
set_connection_parameter_value sgdma_tx.descriptor_write/descriptor_memory.s1 baseAddress 0x08402000
add_connection sgdma_tx.m_read ram_ext.s1 avalon
set_connection_parameter_value sgdma_tx.m_read/ram_ext.s1 baseAddress 0x0000
add_connection usb_tx_dma.descriptor_read descriptor_memory.s1 avalon
set_connection_parameter_value usb_tx_dma.descriptor_read/descriptor_memory.s1 baseAddress 0x08402000
add_connection usb_tx_dma.descriptor_write descriptor_memory.s1 avalon
set_connection_parameter_value usb_tx_dma.descriptor_write/descriptor_memory.s1 baseAddress 0x08402000
add_connection usb_tx_dma.m_read ram_ext.s1 avalon
set_connection_parameter_value usb_tx_dma.m_read/ram_ext.s1 baseAddress 0x0000
add_connection sgdma_tx.out tse_mac.transmit avalon_streaming
add_connection tse_mac.receive sgdma_rx.in avalon_streaming
add_connection usb_tx_dma.out USB2.uplink avalon_streaming
add_connection cpu.d_irq button.irq interrupt
set_connection_parameter_value cpu.d_irq/button.irq irqNumber 9
add_connection cpu.d_irq epcs_controller.irq interrupt
set_connection_parameter_value cpu.d_irq/epcs_controller.irq irqNumber 6
add_connection cpu.d_irq i2c_external.interrupt interrupt
set_connection_parameter_value cpu.d_irq/i2c_external.interrupt irqNumber 8
add_connection cpu.d_irq i2c_main.interrupt interrupt
set_connection_parameter_value cpu.d_irq/i2c_main.interrupt irqNumber 7
add_connection cpu.d_irq jtag_uart.irq interrupt
set_connection_parameter_value cpu.d_irq/jtag_uart.irq irqNumber 10
add_connection cpu.d_irq SDC_SPI.irq interrupt
set_connection_parameter_value cpu.d_irq/SDC_SPI.irq irqNumber 1
add_connection cpu.d_irq sgdma_rx.csr_irq interrupt
set_connection_parameter_value cpu.d_irq/sgdma_rx.csr_irq irqNumber 2
add_connection cpu.d_irq sgdma_tx.csr_irq interrupt
set_connection_parameter_value cpu.d_irq/sgdma_tx.csr_irq irqNumber 3
add_connection cpu.d_irq sys_timer.irq interrupt
set_connection_parameter_value cpu.d_irq/sys_timer.irq irqNumber 4
add_connection cpu.d_irq usb_tx_dma.csr_irq interrupt
set_connection_parameter_value cpu.d_irq/usb_tx_dma.csr_irq irqNumber 5

# exported interfaces
add_interface clk_sys clock sink
set_interface_property clk_sys EXPORT_OF clk_sys.clk_in
add_interface led conduit end
set_interface_property led EXPORT_OF LED.external_connection
add_interface button conduit end
set_interface_property button EXPORT_OF button.external_connection
add_interface sdram conduit end
set_interface_property sdram EXPORT_OF ram_ext.memory
add_interface epcs conduit end
set_interface_property epcs EXPORT_OF epcs_controller.external
add_interface sdram_ctrl conduit end
set_interface_property sdram_ctrl EXPORT_OF ram_ext.external_connection
add_interface lvds2lcds conduit end
set_interface_property lvds2lcds EXPORT_OF LCDS_io.lvds2lcds
add_interface adv3224 conduit end
set_interface_property adv3224 EXPORT_OF crosspoint_switch.adv3224
add_interface i2c_pwr conduit end
set_interface_property i2c_pwr EXPORT_OF i2c_main.i2c
add_interface pg conduit end
set_interface_property pg EXPORT_OF patterngen.pgsig
add_interface control conduit end
set_interface_property control EXPORT_OF main_control.external_connection
add_interface status conduit end
set_interface_property status EXPORT_OF main_status.external_connection
add_interface roc_id conduit end
set_interface_property roc_id EXPORT_OF ROC_addr.external_connection
add_interface sig_clk conduit end
set_interface_property sig_clk EXPORT_OF delay_clk.signal
add_interface sig_sda conduit end
set_interface_property sig_sda EXPORT_OF delay_sda.signal
add_interface sig_ctr conduit end
set_interface_property sig_ctr EXPORT_OF delay_ctr.signal
add_interface sig_tin conduit end
set_interface_property sig_tin EXPORT_OF delay_tin.signal
add_interface i2c_hs conduit end
set_interface_property i2c_hs EXPORT_OF PSI2C.i2c_hs
add_interface sig_d1 conduit end
set_interface_property sig_d1 EXPORT_OF probe_d1.probesignal
add_interface sig_d2 conduit end
set_interface_property sig_d2 EXPORT_OF probe_d2.probesignal
add_interface sd_card2 conduit end
set_interface_property sd_card2 EXPORT_OF SDC_SPI2.external
add_interface ctrl_deser160 conduit end
set_interface_property ctrl_deser160 EXPORT_OF deser160.external_connection
add_interface ctrl_fifo conduit end
set_interface_property ctrl_fifo EXPORT_OF fifo.external_connection
add_interface ctrl_adc conduit end
set_interface_property ctrl_adc EXPORT_OF adc_0.adc
add_interface daq_ch1 conduit end
set_interface_property daq_ch1 EXPORT_OF daq_dma_1.daq_dma
add_interface daq_ch2 conduit end
set_interface_property daq_ch2 EXPORT_OF daq_dma_2.daq_dma
add_interface daq_ch4 conduit end
set_interface_property daq_ch4 EXPORT_OF daq_dma_4.daq_dma
add_interface daq_ch5 conduit end
set_interface_property daq_ch5 EXPORT_OF daq_dma_5.daq_dma
add_interface daq_ch6 conduit end
set_interface_property daq_ch6 EXPORT_OF daq_dma_6.daq_dma
add_interface daq_ch7 conduit end
set_interface_property daq_ch7 EXPORT_OF daq_dma_7.daq_dma
add_interface ctrl_deser400 conduit end
set_interface_property ctrl_deser400 EXPORT_OF deser400.external_connection
add_interface clkdiv_data conduit end
set_interface_property clkdiv_data EXPORT_OF clkdiv.external_connection
add_interface clk_stretch_port conduit end
set_interface_property clk_stretch_port EXPORT_OF clk_stretch.port
add_interface i2c_external conduit end
set_interface_property i2c_external EXPORT_OF i2c_external.i2c
add_interface usb2_ft232h conduit end
set_interface_property usb2_ft232h EXPORT_OF USB2.ft232h
add_interface eventgen conduit end
set_interface_property eventgen EXPORT_OF eventgen.eventgen
add_interface daq_ch0 conduit end
set_interface_property daq_ch0 EXPORT_OF daq_dma_0.daq_dma
add_interface daq_ch3 conduit end
set_interface_property daq_ch3 EXPORT_OF daq_dma_3.daq_dma
add_interface rda_delay conduit end
set_interface_property rda_delay EXPORT_OF rda_delay.in_delay
add_interface trigger_port conduit end
set_interface_property trigger_port EXPORT_OF trigger.trigger_io
add_interface deser400_port conduit end
set_interface_property deser400_port EXPORT_OF deser400_ctrl.deser400_io
add_interface reset_daq reset sink
set_interface_property reset_daq EXPORT_OF clk_daq.clk_in_reset
add_interface clk_daq clock sink
set_interface_property clk_daq EXPORT_OF clk_daq.clk_in
add_interface reset_sys reset sink
set_interface_property reset_sys EXPORT_OF clk_sys.clk_in_reset
add_interface plug_io conduit end
set_interface_property plug_io EXPORT_OF Plug_IO.external_connection

set_interconnect_requirement {$system} qsys_mm.clockCrossingAdapter HANDSHAKE
set_interconnect_requirement {$system} qsys_mm.maxAdditionalLatency 0

save_system dtb_system.qsys
